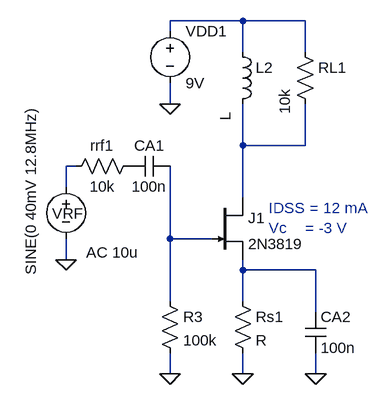
[diagram p0: schematic Jfet.asc]
Jfet.asc, the LTspice schematic file:
Version 4
SHEET 1 1712 680
WIRE 1056 -112 944 -112
WIRE 1152 -112 1056 -112
WIRE 944 -96 944 -112
WIRE 1056 -64 1056 -112
WIRE 1152 -64 1152 -112
WIRE 944 16 944 -16
WIRE 1056 80 1056 16
WIRE 1152 80 1152 16
WIRE 1152 80 1056 80
WIRE 800 112 784 112
WIRE 784 144 784 112
WIRE 1056 160 1056 80
WIRE 944 224 944 112
WIRE 1008 224 944 224
WIRE 784 256 784 224
WIRE 1056 272 1056 256
WIRE 1168 272 1056 272
WIRE 944 320 944 224
WIRE 1056 320 1056 272
WIRE 1168 336 1168 272
WIRE 944 432 944 400
WIRE 1056 432 1056 400
WIRE 1168 432 1168 400
FLAG 1056 432 0
FLAG 784 256 0
FLAG 1168 432 0
FLAG 944 16 0
FLAG 944 432 0
SYMBOL res 896 96 R90
WINDOW 0 0 56 VBottom 2
WINDOW 3 32 56 VTop 2
SYMATTR InstName rrf1
SYMATTR Value 10k
SYMBOL cap 944 96 R90
WINDOW 0 0 32 VBottom 2
WINDOW 3 32 32 VTop 2
SYMATTR InstName CA1
SYMATTR Value 100n
SYMBOL ind 1040 -80 R0
WINDOW 3 -11 122 VLeft 2
SYMATTR InstName L2
SYMBOL res 1136 -80 R0
WINDOW 3 -15 112 VLeft 2
SYMATTR Value 10k
SYMATTR InstName RL1
SYMBOL voltage 784 128 R0
WINDOW 123 31 117 Left 2
WINDOW 39 0 0 Left 0
WINDOW 0 -21 57 Left 2
WINDOW 3 -54 152 VLeft 2
SYMATTR Value2 AC 10u
SYMATTR InstName VRF
SYMATTR Value SINE(0 40mV 12.8MHz)
SYMBOL res 1040 304 R0
SYMATTR InstName Rs1
SYMBOL cap 1152 336 R0
SYMATTR InstName CA2
SYMATTR Value 100n
SYMBOL voltage 944 -112 R0
WINDOW 123 0 0 Left 0
WINDOW 39 0 0 Left 0
SYMATTR InstName VDD1
SYMATTR Value 9V
SYMBOL njf 1008 160 R0
SYMATTR InstName J1
SYMATTR Value 2N3819
SYMBOL res 928 304 R0
SYMATTR InstName R3
SYMATTR Value 100k
TEXT 1096 176 Left 2 ;IDSS = 12 mA\nVc    = -3 V

The netlist it stands for:
* Jfet.asc
rrf1 P001 N003 10k
CA1 N004 P001 100n
L2 N001 N002 L
RL1 N001 N002 10k
VRF N003 0 SINE(0 40mV 12.8MHz) AC 10u
Rs1 N005 0 R
CA2 N005 0 100n
VDD1 N001 0 9V
J1 N002 N004 N005 2N3819
R3 N004 0 100k
.model NJF NJF
.model PJF PJF
.lib standard.jft
* IDSS = 12 mA
* Vc    = -3 V
.backanno
.end